# Altium schematic sheet 3V3_EPS.SchDoc
size 420 x 297 mm; SheetNumber: 4; SheetTotal: 21
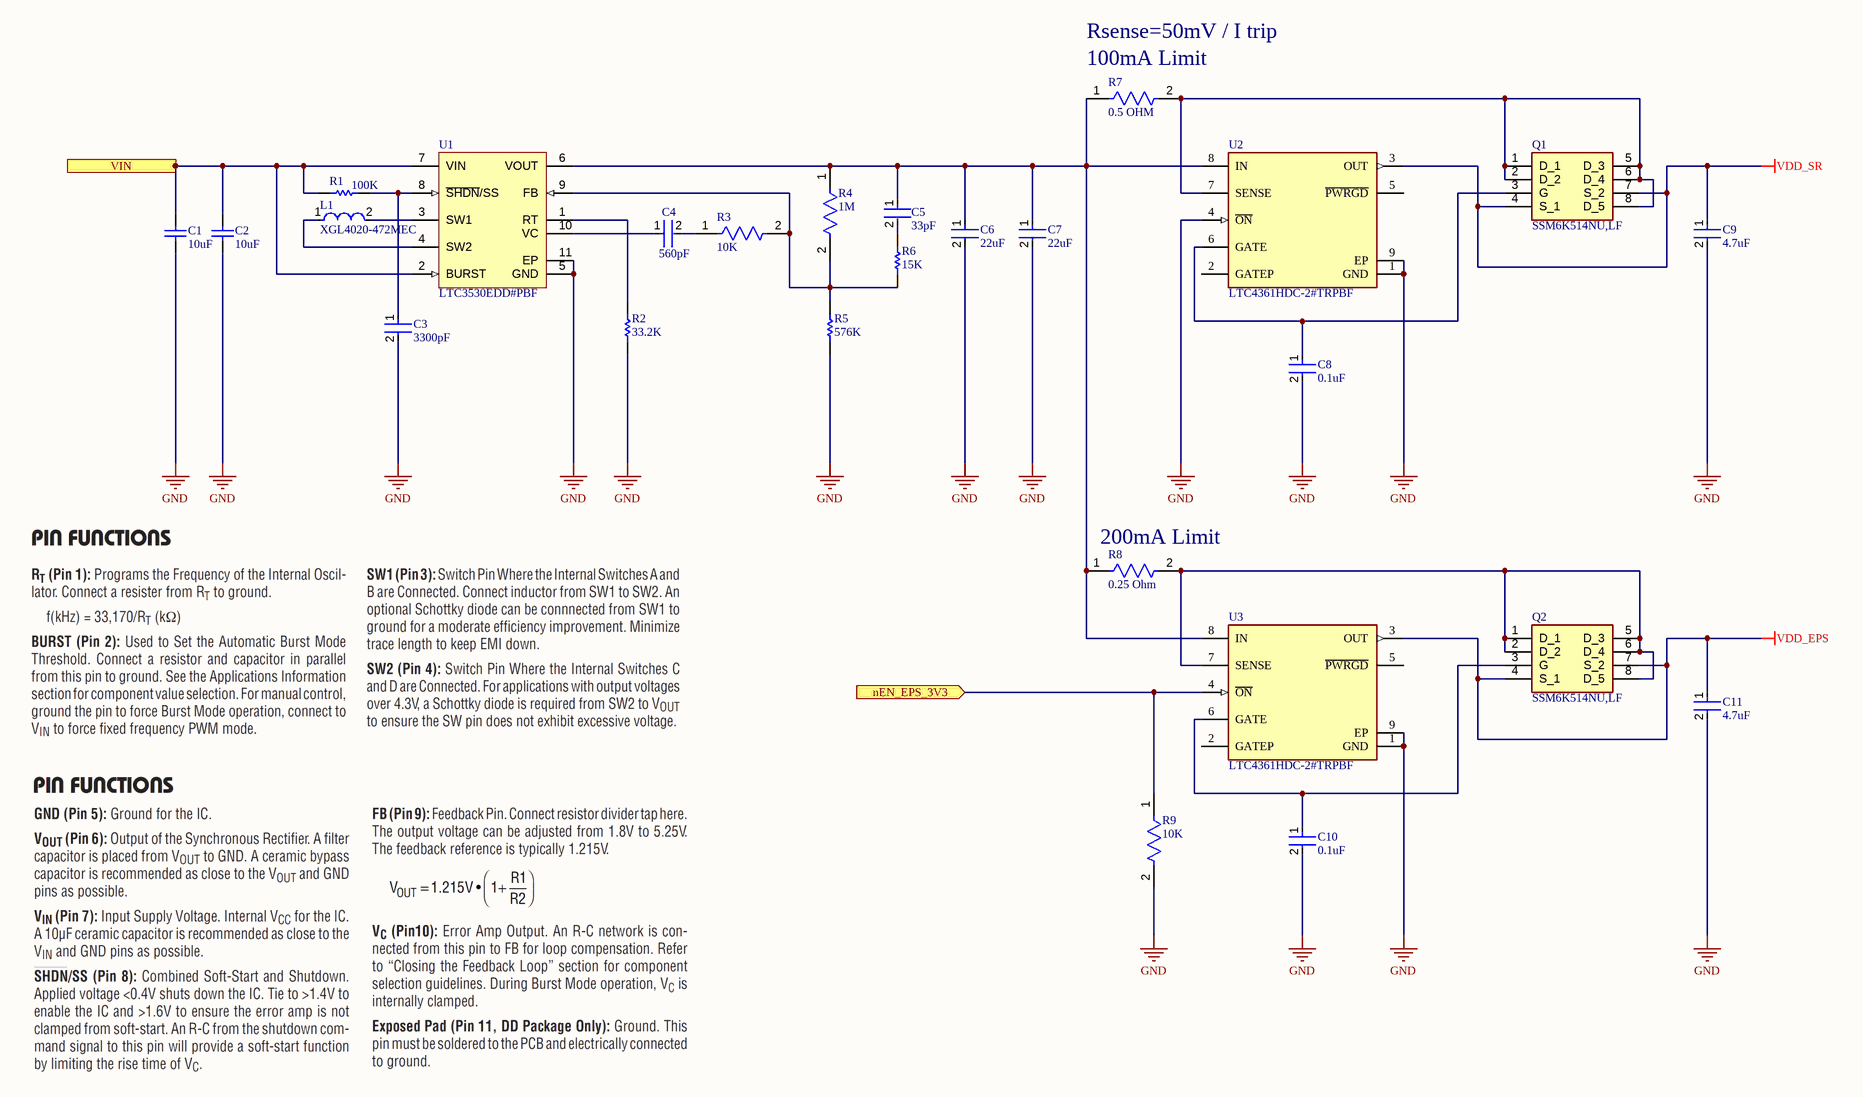
[diagram p0: 3V3_EPS.SchDoc]

## Parts
C1  10uF  [CAPC2013X140X45NL15T25]
C2  10uF  [CAPC2013X140X45NL15T25]
C3  3300pF  [FP-C0603C-CF-MFG]
C4  560pF  [FP-C0603C-CF-MFG]
C5  33pF  [FP-C0603C-CF-MFG]
C6  22uF  [FP-GRM21B-0_2-e0_2_0_7-IPC_C]
C7  22uF  [FP-GRM21B-0_2-e0_2_0_7-IPC_C]
C8  0.1uF  [FP-C0603C-CF-MFG]
C9  4.7uF  [FP-GRM188-0_15-IPC_A]
C10  0.1uF  [FP-C0603C-CF-MFG]
C11  4.7uF  [FP-GRM188-0_15-IPC_A]
L1  XGL4020-472MEC  [FP-XGL4020-MFG]
Q1  SSM6K514NU,LF  [UDFN6B]
Q2  SSM6K514NU,LF  [UDFN6B]
R1  100K  [RESC1608X55X30ML20T10]
R2  33.2K  [RESC1608X55X30NL15T15]
R3  10K  [FP-RK73B1J-MFG]
R4  1M  [FP-ERJ3EK-IPC_C]
R5  576K  [RESC1608X55X30LL15T15]
R6  15K  [RESC1608X55X30NL20T10]
R7  0.5 OHM  [FP-CSR0603-IPC_A]
R8  0.25 Ohm  [FP-CSR0603-IPC_A]
R9  10K  [FP-RK73B1J-MFG]
U1  LTC3530EDD#PBF  [LT-DD-10_V]
U2  LTC4361HDC-2#TRPBF  [FP-DC8-8-05-08-1719-IPC_C]
U3  LTC4361HDC-2#TRPBF  [FP-DC8-8-05-08-1719-IPC_C]

## Ports
nEN_EPS_3V3 (in), VIN

## Nets
GND: C1.1 C2.1 C3.2 C6.2 C7.2 C8.2 C9.2 C10.2 C11.2 R2.1 R5.1 R9.2 U1.5(GND) U1.11(EP) U2.1(GND) U2.4(~{ON}) U2.9(EP) U3.1(GND) U3.9(EP)
VDD_EPS: C11.1 Q2.4(S_1) Q2.7(S_2) U3.3(OUT)
VDD_SR: C9.1 Q1.4(S_1) Q1.7(S_2) U2.3(OUT)
nEN_EPS_3V3: R9.1 U3.4(~{ON}) ; port nEN_EPS_3V3
VIN: C1.2 C2.2 R1.2 U1.2(BURST) U1.7(VIN) ; port VIN
NetC3_1: C3.1 R1.1 U1.8(~{SHDN}/SS)
NetC4_1: C4.1 U1.10(VC)
NetC4_2: C4.2 R3.1
NetC5_1: C5.1 C6.1 C7.1 R4.1 R7.1 R8.1 U1.6(VOUT) U2.8(IN) U3.8(IN)
NetC5_2: C5.2 R6.2
NetC8_1: C8.1 Q1.3(G) U2.6(GATE)
NetC10_1: C10.1 Q2.3(G) U3.6(GATE)
NetL1_1: L1.1 U1.4(SW2)
NetL1_2: L1.2 U1.3(SW1)
NetQ1_1: Q1.1(D_1) Q1.2(D_2) Q1.5(D_3) Q1.6(D_4) Q1.8(D_5) R7.2 U2.7(SENSE)
NetQ2_1: Q2.1(D_1) Q2.2(D_2) Q2.5(D_3) Q2.6(D_4) Q2.8(D_5) R8.2 U3.7(SENSE)
NetR2_2: R2.2 U1.1(RT)
NetR3_2: R3.2 R4.2 R5.2 R6.1 U1.9(FB)

Not connected (* = marked no-connect by the designer): U2 2(GATEP) 5(~{PWRGD}); U3 2(GATEP) 5(~{PWRGD})

## Notes on the sheet
- Rsense=50mV / I trip
- (near R7) 100mA Limit
- (near R8) 200mA Limit
- THIS DOCUMENT AND THE DATA DISCLOSED HEREIN OR
- HEREWITH IS THE PROPERTY OF ALTIUM LIMITED AND MAY
- DWG NO:
- REVISION
- REV:
- DESCRIPTION
- DATE
- APPROVED
- BE FREELY DISTRIBUTED IN WHOLE. NO RIGHTS ARE
- RESERVED OR EXPRESS OR IMPLIED WARANTEE GIVEN.
- ENG:
- APPROVALS
- PROJECT
- DSN:
- CHK:
- REFERENCE DOCUMENTS
- PROJECT REVISION:
- TITLE
- DOCUMENT REVISION:
- DESIGN ITEM:
- BOM:
- FAB DWG:
- PCB DWG:
- ASSY DWG:
- SCALE:
- A3
- SIZE
- CAGE CODE
- FILE NAME
- DWG NO.
- SHEET
- OF
- REV

## Library data of the parts
C1 C2 = CMP-2007-03395-1: 10uF 0805; Part Number: GRM21BR71A106KE51L; Manufacturer: Murata
C3 = CMP-2006-03174-2: CAP CER 3300PF 50V 5% X7R 0603; Manufacturer Part Number: C0603C332J5RACTU; Manufacturer: KEMET; Automotive Grade: Grade 1; Material: Ceramic; Value: 3,300 pF; Temperature Coefficient: 30ppm/°C; Tolerance: 0.05; Temperature Range Low: -55°C; Device Class L3: Ceramic Capacitors; Temperature Characteristic: X7R; Temperature: -55°C to +125°C; Device Class L1: Passive Components; ComponentLink2URL: https://api.kemet.com/component-edge/download/datasheet/C0603C100J5GACAUTO.pdf; Automotive: Yes; Capacitance: 3,300 pF; RoHS: TRUE; Mouser Description: Multilayer Ceramic Capacitors MLCC - SMD/SMT 50volts 3300pF X7R 5%; Height: 0.87mm; Temperature Range High: +125°C; ComponentLink2Description: Datasheet; Voltage Rating: 50 V; Octopart: https://octopart.com/c0603c332j5ractu-kemet-9139905; Package: C0603C-CF; Lead Free: Yes; Device Class L2: Capacitors; Digikey Description: CAP CER 3300PF 50V 5% X7R 0603; Category: Cap
C4 = CMP-2006-03245-2: CAP CER 560PF 50V X7R 0603; Manufacturer Part Number: C0603C561K5RACTU; Manufacturer: KEMET; Tolerance: 0.1; Material: Ceramic; Automotive Grade: Grade 1; Temperature Coefficient: 30ppm/°C; Temperature Range High: +125°C; Category: Cap; Voltage Rating: 50 V; Lead Free: Yes; RoHS: TRUE; Octopart: https://octopart.com/c0603c561k5ractu-kemet-138569; Device Class L3: Ceramic Capacitors; Temperature: -55°C to +125°C; Automotive: Yes; Device Class L1: Passive Components; Mouser Description: C0603C 560pF Ceramic Multilayer Capacitor, 50 VDC, +125degC, X7R Dielec, +/-10%; Capacitance: 560 pF; Temperature Characteristic: X7R; ComponentLink2URL: https://api.kemet.com/component-edge/download/datasheet/C0603C100J5GACAUTO.pdf; Temperature Range Low: -55°C; Digikey Description: CAP CER 560PF 50V X7R 0603; Device Class L2: Capacitors; ComponentLink2Description: Datasheet; Package: C0603C-CF; Value: 560 pF; Height: 0.87mm
C5 = CMP-03020-019617-1: CAP CER 33PF 16V X7R 0603; Manufacturer Part Number: C0603C330K4RAC7867; Manufacturer: KEMET; Material: Ceramic; Temperature Coefficient: 30ppm/°C; Automotive Grade: Grade 1; Tolerance: 0.1; Capacitance: 33 pF; ComponentLink2Description: Datasheet; ComponentLink2URL: https://api.kemet.com/component-edge/download/datasheet/C0603C100J5GACAUTO.pdf; Height: 0.87mm; Octopart: https://octopart.com/c0603c330k4rac7867-kemet-83501964; Temperature Characteristic: X7R; Temperature: -55°C to +125°C; RoHS: TRUE; Device Class L3: Ceramic Capacitors; Device Class L1: Passive Components; Digikey Description: CAP CER 33PF 16V X7R 0603; Lead Free: Yes; Temperature Range High: +125°C; Voltage Rating: 16 V; Package: C0603C-CF; Category: Cap; Automotive: Yes; Temperature Range Low: -55°C; Device Class L2: Capacitors; Value: 33 pF
C6 C7 = CMP-06035-025845-1: Chip Multilayer Ceramic Capacitors for General Purpose, 0805, 22uF, X7T, +22%/-33%, 20%, 10V; Dissipation Factor: 0.035%; Height: 1.25mm; Min Operating Temperature: -55°C; Case/Package: 0805; Packaging: Tape and Reel; Voltage: 10V; Depth: 1.25mm; Width: 1.25mm; Voltage Rating: 10V; Dielectric: X7T; Weight: 0.000335oz; Capacitance: 22uF; Mount: Surface Mount; Package Quantity: 3000; Lead Free: Lead Free; Tolerance: 20%; Thickness: 0.057inch; Max Operating Temperature: 125°C; Length: 2mm; Material: Ceramic; Case Code (Metric): 2012; Termination: SMD/SMT; Voltage Rating (DC): 10V; Dielectric Material: Ceramic; Case Code (Imperial): 0805
C8 C10 = CMP-2006-03054-2: CAP CER 0.1UF 16V X7R 0603; Manufacturer: KEMET; Manufacturer Part Number: C0603C104J4RACTU; Material: Ceramic; Capacitance: 0.10 μF; Tolerance: 0.05; Automotive Grade: Grade 1; Value: 0.10 μF; Temperature Coefficient: 30ppm/°C; Digikey Description: CAP CER 0.1UF 16V X7R 0603; Automotive: Yes; Octopart: https://octopart.com/c0603c104j4ractu-kemet-102515; Device Class L2: Capacitors; Temperature Characteristic: X7R; Category: Cap; Mouser Description: Cap Ceramic 0.1uF 16V X7R 5% SMD 0603 125°C Paper T/R; Voltage Rating: 16 V; Temperature Range Low: -55°C; Device Class L1: Passive Components; ComponentLink2URL: https://api.kemet.com/component-edge/download/datasheet/C0603C100J5GACAUTO.pdf; Lead Free: Yes; Temperature Range High: +125°C; Height: 0.87mm; Device Class L3: Ceramic Capacitors; ComponentLink2Description: Datasheet; Package: C0603C-CF; RoHS: TRUE; Temperature: -55°C to +125°C
C9 C11 = CMP-06035-000034-2: CAP CER 4.7UF 10V X7S 0603; Material: Ceramic; Tolerance: 10%; Height: 0.8mm; Termination: SMD/SMT; Case Code (Metric): 1608; Voltage Rating: 10V; Width: 0.8mm; Resistor Type: Ceramic; Length: 1.6mm; Voltage Rating (DC): 10V; Weight: 0.000222oz; Dielectric: X7S; Package Quantity: 4000; Mount: Surface Mount; Case Code (Imperial): 0603; Case/Package: 0603; Packaging: Tape and Reel; Thickness: 0.037inch; Min Operating Temperature: -55°C; Capacitance: 4.7uF; Max Operating Temperature: 125°C
L1 = CMP-11268-000013-1: Inductor, power, 4.7uH, SMT; Manufacturer: Coilcraft; Self Resonant Frequency: 23MHz; Saturation Current: 1.9A; Shielding: true; Test Frequency: 1MHz; Tolerance: 20%; Rms Current: 5.6A; Core Material: Composite; Series Resistance: 47.3mΩ; Automotive Grade: Grade 1; Standoff Height: 0.06mm; Inductance: 4.7uH; ComponentLink2Description: Datasheet; Value: 4.7uH; Automotive: Yes; RoHS: TRUE; Device Class L1: Passive Components; Category: Ind; Manufacturer Part Number: XGL4020-472MEC; ComponentLink2URL: https://www.coilcraft.com/pdfs/xgl4020.pdf; Ambient Temperature Range Low: -40°C; Height: 2.1mm; Octopart: https://octopart.com/xgl4020-472mec-coilcraft-99681031; Device Class L2: Inductors; Ambient Temperature Range High: +125°C; Package: XGL4020; Lead Free: Yes; Composition: Wirewound; Device Class L3: Fixed Inductors
Q1 Q2 = SSM6K514NU,LF: MOSFET (N-Channel); Manufacturer_Name: Toshiba; Datasheet Link: http://toshiba.semicon-storage.com/info/docget.jsp?did=29875&prodName=SSM6N7002CFU; Manufacturer_Part_Number: SSM6K514NU,LF; Mouser Part Number: 757-SSM6K514NULF; Mouser Price/Stock: https://www.mouser.co.uk/ProductDetail/Toshiba/SSM6K514NULF?qs=yfGysFjEcj13lHFOvblArQ%3D%3D; Arrow Part Number: SSM6K514NU,LF; Arrow Price/Stock: https://www.arrow.com/en/products/ssm6k514nulf/toshiba?region=nac
R1 = CMP-2000-01852-1: Part Number: RK73B1JTTD104J; Manufacturer: KOA Speer
R2 = CMP-2000-00441-1: Part Number: ERJ-3EKF3322V; Manufacturer: Panasonic
R3 R9 = CMP-2000-01851-2: RES 10K OHM 5% 1/10W 0603; Temperature Coefficient: 200ppm/°C; Voltage Rating: 50V; Power Rating: 100mW; Resistance: 10kR; Length: 1.6mm; Lead Free: Lead Free; Resistance Tolerance: 5%; Case Code (Metric): 1608; Width: 0.8mm; Height: 0.45mm; Max Operating Temperature: 155°C; RoHS Compliant: Yes; Resistor Type: Thick Film; Min Operating Temperature: -55°C; Case Code (Imperial): 0603; Technology: THICK FILM; Package Quantity: 5000; Tolerance: 5%; Case/Package: 0603; Voltage Rating (DC): 50V; Depth: 0.8mm; Packaging: Tape and Reel; Number of Pins: 2; Construction: Rectangular; Series: RK73B; Military Standard: Not; Termination: SMD/SMT
R4 = CMP-1012-00849-3: RES SMD 1M OHM 1% 1/10W 0603; Resistance: 1MR; Voltage Rating: 75V; Temperature Coefficient: 100ppm/°C; Power Rating: 100mW; REACH SVHC: No SVHC; Radiation Hardening: No; Features: Automotive AEC-Q200; Case Code (Metric): 1608; Resistance Tolerance: 1%; Case/Package: 0603; Termination: SMD/SMT; Max Operating Temperature: 155°C; Tolerance: 1%; Size Code: 0603; Case Code (Imperial): 0603; Min Operating Temperature: -55°C; Number of Pins: 2; Mount: Surface Mount; Package Quantity: 1; Military Standard: Not; Voltage Rating (DC): 75V; Depth: 0.8mm; Packaging: Tape and Reel; Width: 0.8mm; Number of Terminations: 2; Length: 1.6mm; Height: 0.022inch; RoHS Compliant: Yes; Resistor Type: Thick Film; Contact Plating: Tin; Lead Free: Lead Free; Series: ERJ; Construction: Rectangular; Max Power Dissipation: 100mW
R5 = CMP-2000-00577-1: 576K Ohm 0603; Part Number: ERJ-3EKF5763V; Manufacturer: Panasonic
R6 = CMP-2000-01876-1: 15K Ohm 0603; Part Number: RK73B1JTTD153J; Manufacturer: KOA Speer
R7 = CMP-26527-000571-1: General Purpose Thick Film Chip Resistor, 0603, 0.5Ω, 1%, 300ppm/°C, 0.125W; Resistance: 500mR; Max Power Dissipation: 125mW; Resistor Type: Thick Film; Series: CSR; Case/Package: 0603; Mount: Surface Mount; Tolerance: 1%; Max Operating Temperature: 155°C; Width: 0.031inch; Length: 0.063inch; Min Operating Temperature: -55°C; Contact Plating: Tin; Size Code: 0603; Lead Free: Lead Free; Height: 0.022inch; Case Code (Imperial): 0603; Packaging: Tape and Reel; Power Rating: 125mW; RoHS Compliant: Yes; Case Code (Metric): 1608; Temperature Coefficient: 300ppm/°C; Number of Terminations: 2
R8 = CMP-26527-001850-1: General Purpose Thick Film Chip Resistor, 0603, 0.25Ω, 1%, 300ppm/°C, 0.125W; Max Power Dissipation: 125mW; Resistance: 250mR; Length: 0.063inch; Case Code (Metric): 1608; Temperature Coefficient: 300ppm/°C; Mount: Surface Mount; RoHS Compliant: Yes; Height: 0.022inch; Case/Package: 0603; Series: CSR; Max Operating Temperature: 155°C; Case Code (Imperial): 0603; Min Operating Temperature: -55°C; Lead Free: Lead Free; Resistor Type: Thick Film; Tolerance: 1%; Width: 0.031inch; Packaging: Tape and Reel; Number of Terminations: 2; Contact Plating: Tin
U1 = CMP-0492-00076-1: Wide Input Voltage Synchronous Buck-Boost DC/DC Converter, 10-pin SON (DD-10), -40 to 85 degC, Pb-Free; Manufacturer: Linear Technology; Frequency Adjust Range: 300kHz - 2MHz; Number of Outputs: 1; ComponentLink1URL: http://www.linear.com/; RoHS: TRUE; ComponentLink2URL: http://cds.linear.com/docs/en/datasheet/3530fb.pdf; ComponentLink3URL: http://cds.linear.com/docs/en/packaging/DFN_10_05-08-1699.pdf; PackageDescription: 10-Pin Plastic DFN, Body 3 x 3 mm, Pitch 0.5 mm; PackageReference: DD-10; ComponentLink1Description: Manufacturer URL; PackageVersion: Rev. C, 06/2010; Mounting Technology: Surface Mount; ComponentLink3Description: Package Specification; ComponentLink2Description: Datasheet; PartNumber: LTC3530EDD#PBF; DatasheetVersion: Rev. B; Code_JEDEC: MO-229
U2 U3 = CMP-0474-00015-2: IC OVP/OCP PROTECTION CTLR 8DFN; Number of Circuits: 1; RoHS Compliant: Yes; Packaging: Tape and Reel; Case/Package: DFN; Number of Pins: 8; Package Quantity: 2500